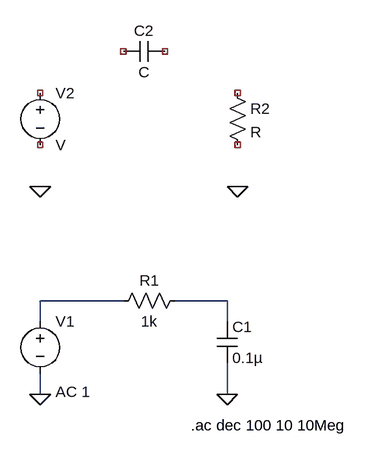
[diagram p0: schematic SIMULACION-LC-AC.asc]
SIMULACION-LC-AC.asc, the LTspice schematic file:
Version 4.1
SHEET 1 880 680
WIRE 144 64 16 64
WIRE 304 64 224 64
WIRE 16 96 16 64
WIRE 304 96 304 64
WIRE 16 208 16 176
WIRE 304 208 304 160
FLAG 16 208 0
FLAG 304 208 0
FLAG 16 -112 0
FLAG 320 -112 0
SYMBOL voltage 16 80 R0
WINDOW 123 24 124 Left 2
WINDOW 39 0 0 Left 0
SYMATTR InstName V1
SYMATTR Value ""
SYMATTR Value2 AC 1
SYMBOL res 240 48 R90
WINDOW 0 0 56 VBottom 2
WINDOW 3 32 56 VTop 2
SYMATTR InstName R1
SYMATTR Value 1k
SYMBOL cap 288 96 R0
SYMATTR InstName C1
SYMATTR Value 0.1µ
SYMBOL voltage 16 -272 R0
SYMATTR InstName V2
SYMBOL res 304 -272 R0
SYMATTR InstName R2
SYMBOL cap 208 -336 R90
WINDOW 0 0 32 VBottom 2
WINDOW 3 32 32 VTop 2
SYMATTR InstName C2
TEXT 248 256 Left 2 !.ac dec 100 10 10Meg

The netlist it stands for:
* SIMULACION-LC-AC.asc
V1 N001 0 AC 1
R1 N002 N001 1k
C1 N002 0 0.1µ
V2 NC_01 NC_02 V
R2 NC_03 NC_04 R
C2 NC_05 NC_06 C
.ac dec 100 10 10Meg
.backanno
.end